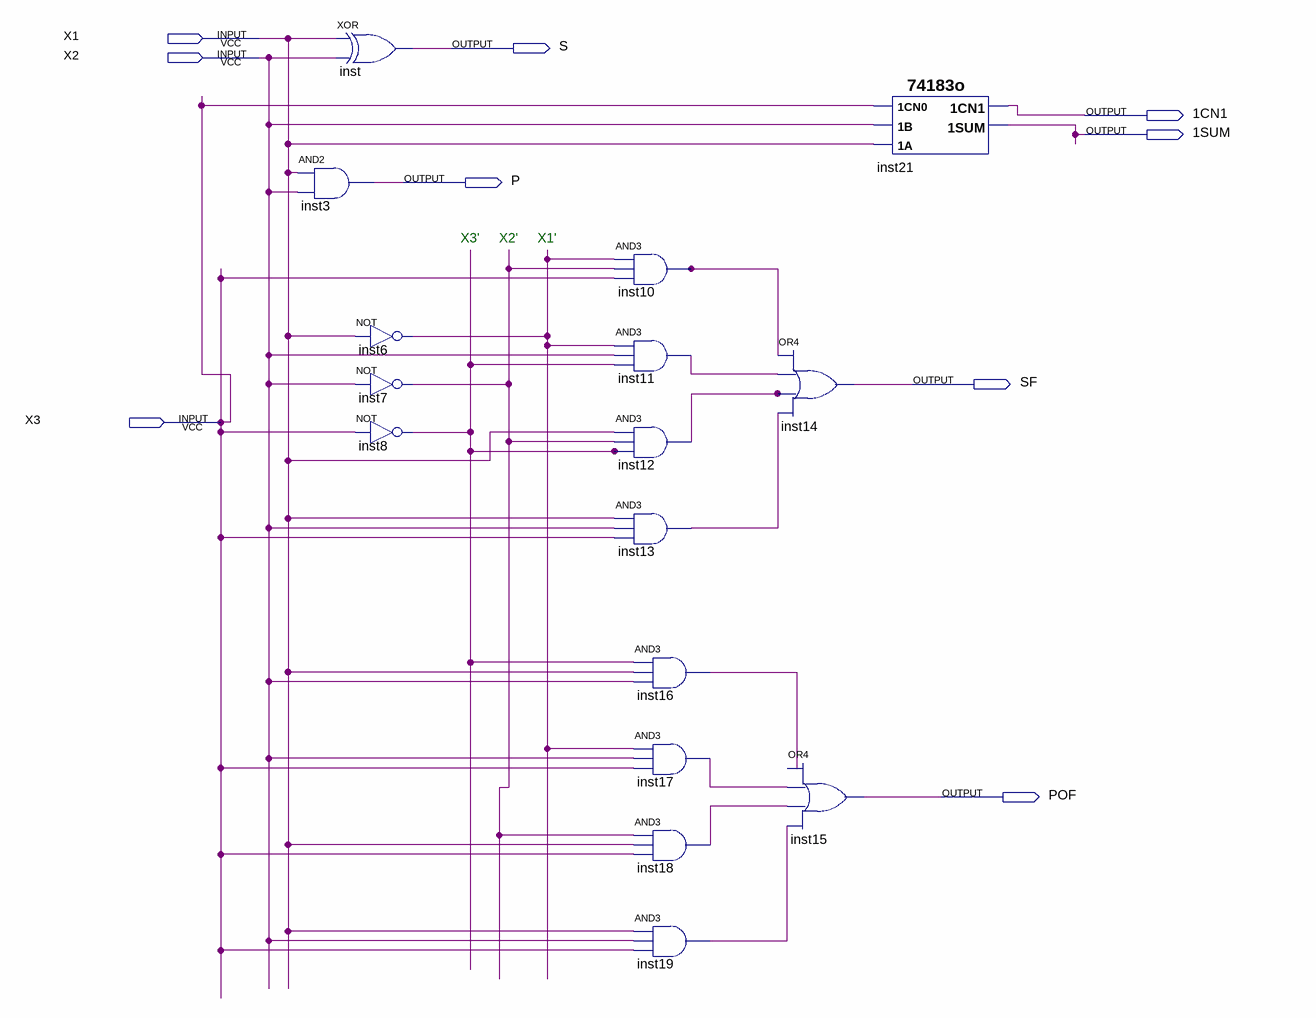
[diagram p0: schematic sheet]
// Quartus schematic Block5.bdf as structural Verilog: 16 symbols, 9 pins
module Block5 (
  input  X1,
  input  X2,
  input  X3,
  output S,
  output \1CN1 ,
  output \1SUM ,
  output P,
  output SF,
  output POF
);

  wire inst6_out, inst7_out, inst8_out, inst10_out, inst11_out, inst12_out, inst13_out, inst16_out,
       inst17_out, inst18_out, inst19_out;

  and inst3 (P, X1, X2);
  xor inst (S, X1, X2);
  not inst6 (inst6_out, X1);
  not inst7 (inst7_out, X2);
  not inst8 (inst8_out, X3);
  and inst10 (inst10_out, inst6_out, inst7_out, X3);
  and inst11 (inst11_out, inst6_out, X2, inst8_out);
  and inst12 (inst12_out, X1, inst7_out, inst8_out);
  and inst13 (inst13_out, X1, X2, X3);
  and inst16 (inst16_out, inst8_out, X1, X2);
  and inst17 (inst17_out, inst6_out, X2, X3);
  and inst18 (inst18_out, inst7_out, X1, X3);
  and inst19 (inst19_out, X1, X2, X3);
  or inst14 (SF, inst10_out, inst11_out, inst12_out, inst13_out);
  or inst15 (POF, inst16_out, inst17_out, inst18_out, inst19_out);
  \74183o  inst21 (.\1CN0 (X3), .\1A (X1), .\1B (X2), .\1CN1 (\1CN1 ), .\1SUM (\1SUM ));

  // Notes on the sheet:
  //   X3'
  //   X2'
  //   X1'
endmodule
